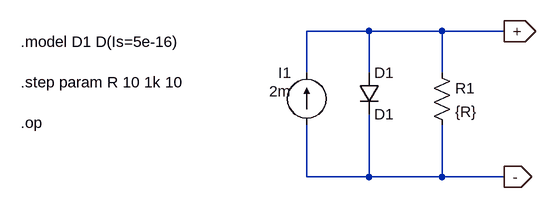
[diagram p0: schematic schematic.asc]
schematic.asc, the LTspice schematic file:
Version 4.1
SHEET 1 880 680
WIRE 160 64 64 64
WIRE 272 64 160 64
WIRE 368 64 272 64
WIRE 64 128 64 64
WIRE 160 128 160 64
WIRE 272 128 272 64
WIRE 64 288 64 208
WIRE 160 288 160 192
WIRE 160 288 64 288
WIRE 272 288 272 208
WIRE 272 288 160 288
WIRE 368 288 272 288
FLAG 368 64 +
IOPIN 368 64 Out
FLAG 368 288 -
IOPIN 368 288 Out
SYMBOL current 64 208 R180
WINDOW 0 24 80 Left 2
WINDOW 3 24 52 Left 2
WINDOW 123 0 0 Left 0
WINDOW 39 0 0 Left 0
SYMATTR InstName I1
SYMATTR Value 2m
SYMBOL diode 144 128 R0
SYMATTR InstName D1
SYMATTR Value D1
SYMBOL res 256 112 R0
SYMATTR InstName R1
SYMATTR Value {R}
TEXT -376 80 Left 2 !.model D1 D(Is=5e-16)\n \n.step param R 10 1k 10\n \n.op

The netlist it stands for:
* schematic.asc
I1 - + 2m
D1 + - D1
R1 + - {R}
.model D D
.lib standard.dio
.model D1 D(Is=5e-16)
.step param R 10 1k 10
.op
.backanno
.end

* Results of the author's LTspice run, read from the files saved beside the schematic
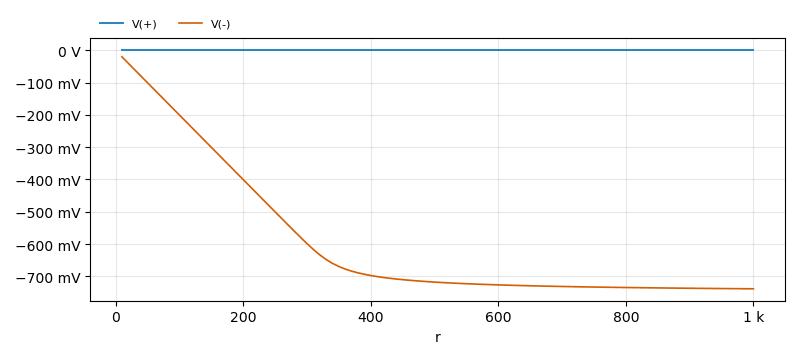
[diagram p1: Operating Point of schematic.asc, plotted from the saved traces]
* Operating Point, 1 run:
*   V(+): 3.781e-11 fV at r=10 , 1.054e-09 fV at r=1 k, min -6.088e-09 fV, max 4.048e-09 fV
*   V(-): -20 mV at r=10 , -738.6 mV at r=1 k, min -738.6 mV, max -20 mV